# EAGLE design dlr (EAGLE 6.5.0)
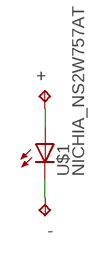
[diagram p0: schematic, sheet 1]

## Parts
+  TPTP20SQ  [TP20SQ]
-  TPTP20SQ  [TP20SQ]
U$1  NICHIA_NS2W757AT  [NICHIA_NS2W757AT]

## Nets
+: +.TP U$1.ANODE(A)
-: -.TP U$1.CATHODE(C)

## Library data of the parts
+ - = testpad:TP: Test pad
U$1 = ulader:NICHIA_NS2W757AT: Nichia NS2W757AT * white * If = 65-100mA Source http://www.leds.de/Low-Mid-Power-LEDs/SMD-LEDs/Nichia-NS2W757AT-25lm-weiss.html

## Board
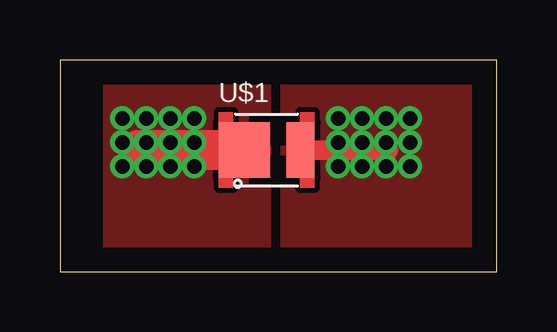
[diagram p1: board, top side]
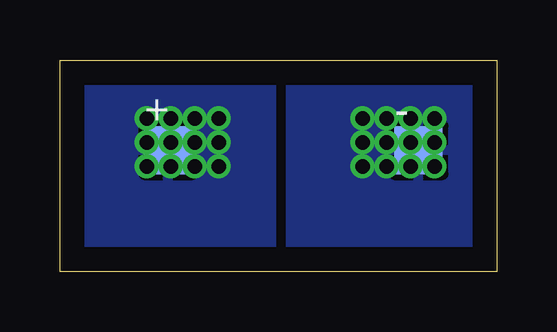
[diagram p2: board, bottom side, seen from below]

Size 18.22 x 8.83 mm. Coordinates in mm from the lower left corner, seen from the top.
Outline: 0,0 18.22,0 18.22,8.83 0,8.83 0,0
Copper layers (1*16): Top 0.035mm / dielectric 1.5mm / Bottom 0.035mm
Design rules "default": minimum track width 10mil, minimum drill 24mil, track to track 8mil, track to pad 8mil, pad to pad 8mil, via to via 8mil, smd to smd 8mil, copper to edge 40mil, drill to drill 8mil, minimum pad ring 10mil, minimum via ring 8mil, stop-mask expansion 4mil, vias tented up to drill 0mil, thermal gap 10mil

### Footprints (pad centres in the part's own frame; a part is rotated, then mirrored left to right if it is on the bottom)
TP20SQ = smd 2 x 2: TP 0,0
NICHIA_NS2W757AT = smd 1.18 x 2.3: ANODE 1.41,0 | smd 2.13 x 2.3: CATHODE -0.935,0

### Placement (x,y rotation side)
+  13.7,5.08 0 bottom
-  3.27,5.08 0 bottom
U$1  8.62,5.08 0 top

### Tracks (layer width: path | path; a pad name or v marks a point on that pad's centre or on a via)
+  (via drill 0.6)
  Top 0.813: U$1.ANODE +.TP
  other vias: 11.6,6.4 12.6,6.4 13.6,6.4 14.6,6.4 14.6,5.4 13.6,5.4 12.6,5.4 11.6,5.4 11.6,4.4 12.6,4.4 13.6,4.4 14.6,4.4
  pour Top: 9.4,9 18.2,9 18.2,0 9.4,0
  pour Bottom: 9.4,0 9.4,8.8 18.2,8.8 18.2,0
-  (via drill 0.6)
  Top 1.676: U$1.CATHODE -.TP
  other vias: 2.6,6.4 3.6,6.4 4.6,6.4 5.6,6.4 5.6,5.4 4.6,5.4 3.6,5.4 2.6,5.4 2.6,4.4 3.6,4.4 4.6,4.4 5.6,4.4
  pour Top: 2,9 8.6,9 8.6,0 2,0
  pour Bottom: 8.6,8.8 8.6,0 0,0 0,8.8